# Altium schematic sheet MOD_PWR_SW_CHM.SchDoc
size A4
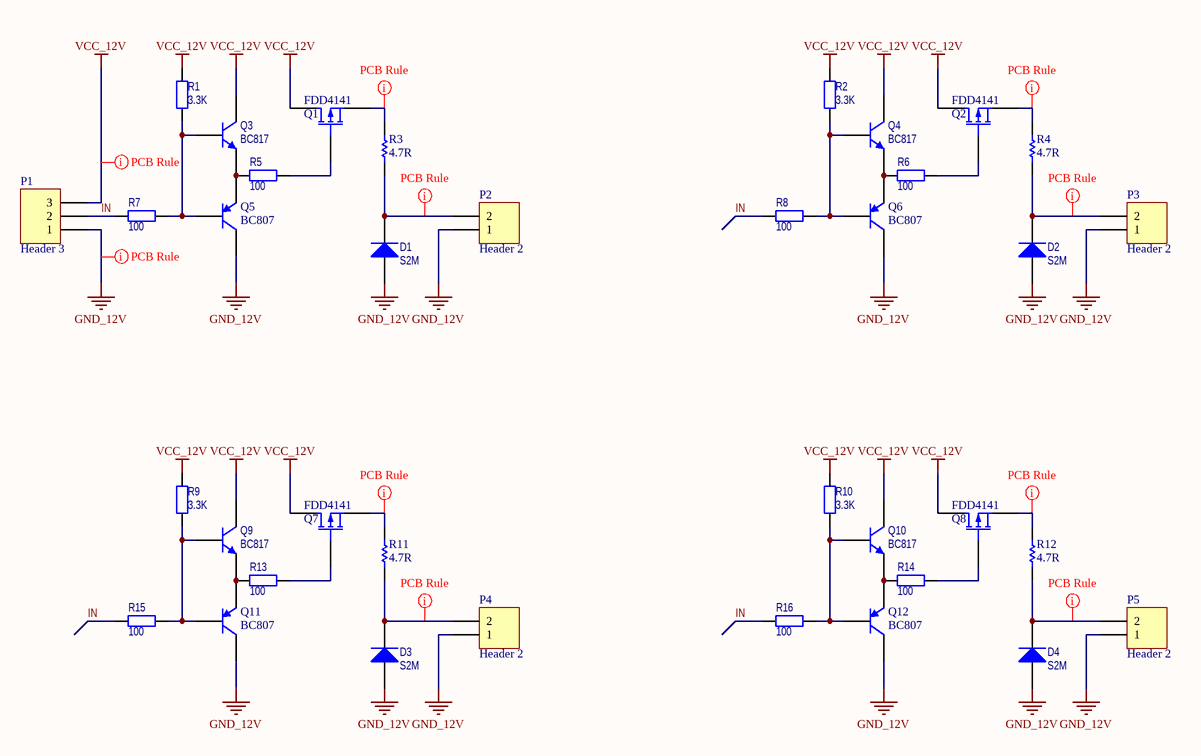
[diagram p0: MOD_PWR_SW_CHM.SchDoc]

## Parts
D1  S2M  [SMB]
D2  S2M  [SMB]
D3  S2M  [SMB]
D4  S2M  [SMB]
P1  Header 3  [HDR1X3]
P2  Header 2  [PCBComponent_1]
P3  Header 2  [PCBComponent_1]
P4  Header 2  [PCBComponent_1]
P5  Header 2  [PCBComponent_1]
Q1  FDD4141  [TO-252]
Q2  FDD4141  [TO-252]
Q3  BC817  [SOT23_M]
Q4  BC817  [SOT23_M]
Q5  BC807  [SOT23_M]
Q6  BC807  [SOT23_M]
Q7  FDD4141  [TO-252]
Q8  FDD4141  [TO-252]
Q9  BC817  [SOT23_M]
Q10  BC817  [SOT23_M]
Q11  BC807  [SOT23_M]
Q12  BC807  [SOT23_M]
R1  value 3.3K  [6-0805_N]  (hidden comment: Res2)
R2  value 3.3K  [6-0805_N]  (hidden comment: Res2)
R3  value 4.7R  [PCBComponent_1]  (hidden comment: Res1)
R4  value 4.7R  [PCBComponent_1]  (hidden comment: Res1)
R5  value 100  [6-0805_N]  (hidden comment: Res2)
R6  value 100  [6-0805_N]  (hidden comment: Res2)
R7  value 100  [6-0805_N]  (hidden comment: Res2)
R8  value 100  [6-0805_N]  (hidden comment: Res2)
R9  value 3.3K  [6-0805_N]  (hidden comment: Res2)
R10  value 3.3K  [6-0805_N]  (hidden comment: Res2)
R11  value 4.7R  [PCBComponent_1]  (hidden comment: Res1)
R12  value 4.7R  [PCBComponent_1]  (hidden comment: Res1)
R13  value 100  [6-0805_N]  (hidden comment: Res2)
R14  value 100  [6-0805_N]  (hidden comment: Res2)
R15  value 100  [6-0805_N]  (hidden comment: Res2)
R16  value 100  [6-0805_N]  (hidden comment: Res2)

## Nets
GND_12V: D1.1(A) D2.1(A) D3.1(A) D4.1(A) P1.1 P2.1 P3.1 P4.1 P5.1 Q5.3(C) Q6.3(C) Q11.3(C) Q12.3(C)
VCC_12V: P1.3 Q1.1(D) Q2.1(D) Q3.1(C) Q4.1(C) Q7.1(D) Q8.1(D) Q9.1(C) Q10.1(C) R1.1 R2.1 R9.1 R10.1
IN: P1.2 R7.2 R8.2 R15.2 R16.2
NetD1_2: D1.2(K) P2.2 R3.1
NetD2_2: D2.2(K) P3.2 R4.1
NetD3_2: D3.2(K) P4.2 R11.1
NetD4_2: D4.2(K) P5.2 R12.1
NetQ1_2: Q1.2(G) R5.1
NetQ1_3: Q1.3(S) R3.2
NetQ2_2: Q2.2(G) R6.1
NetQ2_3: Q2.3(S) R4.2
NetQ3_2: Q3.2(B) Q5.2(B) R1.2 R7.1
NetQ3_3: Q3.3(E) Q5.1(E) R5.2
NetQ4_2: Q4.2(B) Q6.2(B) R2.2 R8.1
NetQ4_3: Q4.3(E) Q6.1(E) R6.2
NetQ7_2: Q7.2(G) R13.1
NetQ7_3: Q7.3(S) R11.2
NetQ8_2: Q8.2(G) R14.1
NetQ8_3: Q8.3(S) R12.2
NetQ9_2: Q9.2(B) Q11.2(B) R9.2 R15.1
NetQ9_3: Q9.3(E) Q11.1(E) R13.2
NetQ10_2: Q10.2(B) Q12.2(B) R10.2 R16.1
NetQ10_3: Q10.3(E) Q12.1(E) R14.2

## Layout directives
rule Undefined; rule Width Constraint [Pref Width = 40mil    Min Width = 10mil    Max Width = 50mil]: GND_12V, NetD1_2, NetD2_2, NetD3_2, NetD4_2, NetQ1_3, NetQ2_3, NetQ7_3, NetQ8_3, VCC_12V

## Library data of the parts
D1-D4 = Diode: Default Diode; Published: 8-Jun-2000; LatestRevisionDate: 17-Jul-2002; LatestRevisionNote: Re-released for DXP Platform.; PackageVersion: Sep-1996; PackageReference: SMC; Publisher: Altium Limited; PackageDescription: DO-214-AB/SMC; 2 C-Bend Leads; Body 7.9 x 5.9 mm, inc. leads (LxW); Code_JEDEC: DO-214-AB
P1 = Header 3: Header, 3-Pin; LatestRevisionDate: 17-Jul-2002; LatestRevisionNote: Re-released for DXP Platform.; Publisher: Altium Limited
P2-P5 = Header 2: Header, 2-Pin; LatestRevisionDate: 17-Jul-2002; LatestRevisionNote: Re-released for DXP Platform.; Publisher: Altium Limited
Q1 Q2 Q7 Q8 = MOSFET-P: P-Channel MOSFET; pin to pad: 1>4 2>1; Published: 8-Jun-2000; LatestRevisionDate: 17-Jul-2002; LatestRevisionNote: Re-released for DXP Platform.; PackageVersion: 1995/1996; PackageReference: E3; Publisher: Altium Limited; PackageDescription: TO, Flat Index; 3 In-Line, Axial Leads; Body Dia. 4.6mm; Lead Dia. 0.5 mm (max)
Q3 Q4 Q9 Q10 = QNPN: NPN Bipolar Transistor; pin to pad: 2>3 3>2; Published: 8-Jun-2000; LatestRevisionDate: 29-May-2009; LatestRevisionNote: IPC-7351 Footprint Added.; PackageVersion: Aug-1999; PackageReference: SOT-23B; Publisher: Altium Limited; PackageDescription: 3-Pin SOT-23 Package 0.95 mm Pitch, 2.4 mm Lead Span
Q5 Q6 Q11 Q12 = 2N3906: PNP General Purpose Amplifier; Published: 8-Jun-2000; LatestRevisionDate: 15-Jan-2003; LatestRevisionNote: PCB Footprint 'BCY-W3/D4.7' replaced; DatasheetVersion: 1997; PackageVersion: Sep-1998; PackageReference: TO-92A; Publisher: Altium Limited; PackageDescription: TO, Flat Index; 3 In-Line, Axial Leads; Body Dia. 4.5mm; Leads 0.51 x 0.48 mm (max); ComponentLink1Description: Manufacturer Link; ComponentLink1URL: http://www.fairchildsemi.com/; ComponentLink2Description: Datasheet; ComponentLink2URL: http://www.fairchildsemi.com/ds/2N%2F2N3906.pdf
R1 R2 R5-R10 R13-R16 = Res2: Resistor; Published: 8-Jun-2000; LatestRevisionDate: 17-Jul-2002; LatestRevisionNote: Re-released for DXP Platform.; PackageReference: AXIAL-0.4; Publisher: Altium Limited; PackageDescription: Axial Device, Thru-Hole; 2 Leads; 0.4 in Pin Spacing
R3 R4 R11 R12 = Res1: Resistor; Published: 8-Jun-2000; LatestRevisionDate: 17-Jul-2002; LatestRevisionNote: Re-released for DXP Platform.; PackageReference: AXIAL-0.3; Publisher: Altium Limited; PackageDescription: Axial Device, Thru-Hole; 2 Leads; 0.3 in Pin Spacing